# EAGLE schematic SVCSYNTH00 (EAGLE 7.7.0)

## Sheet 1 of 4
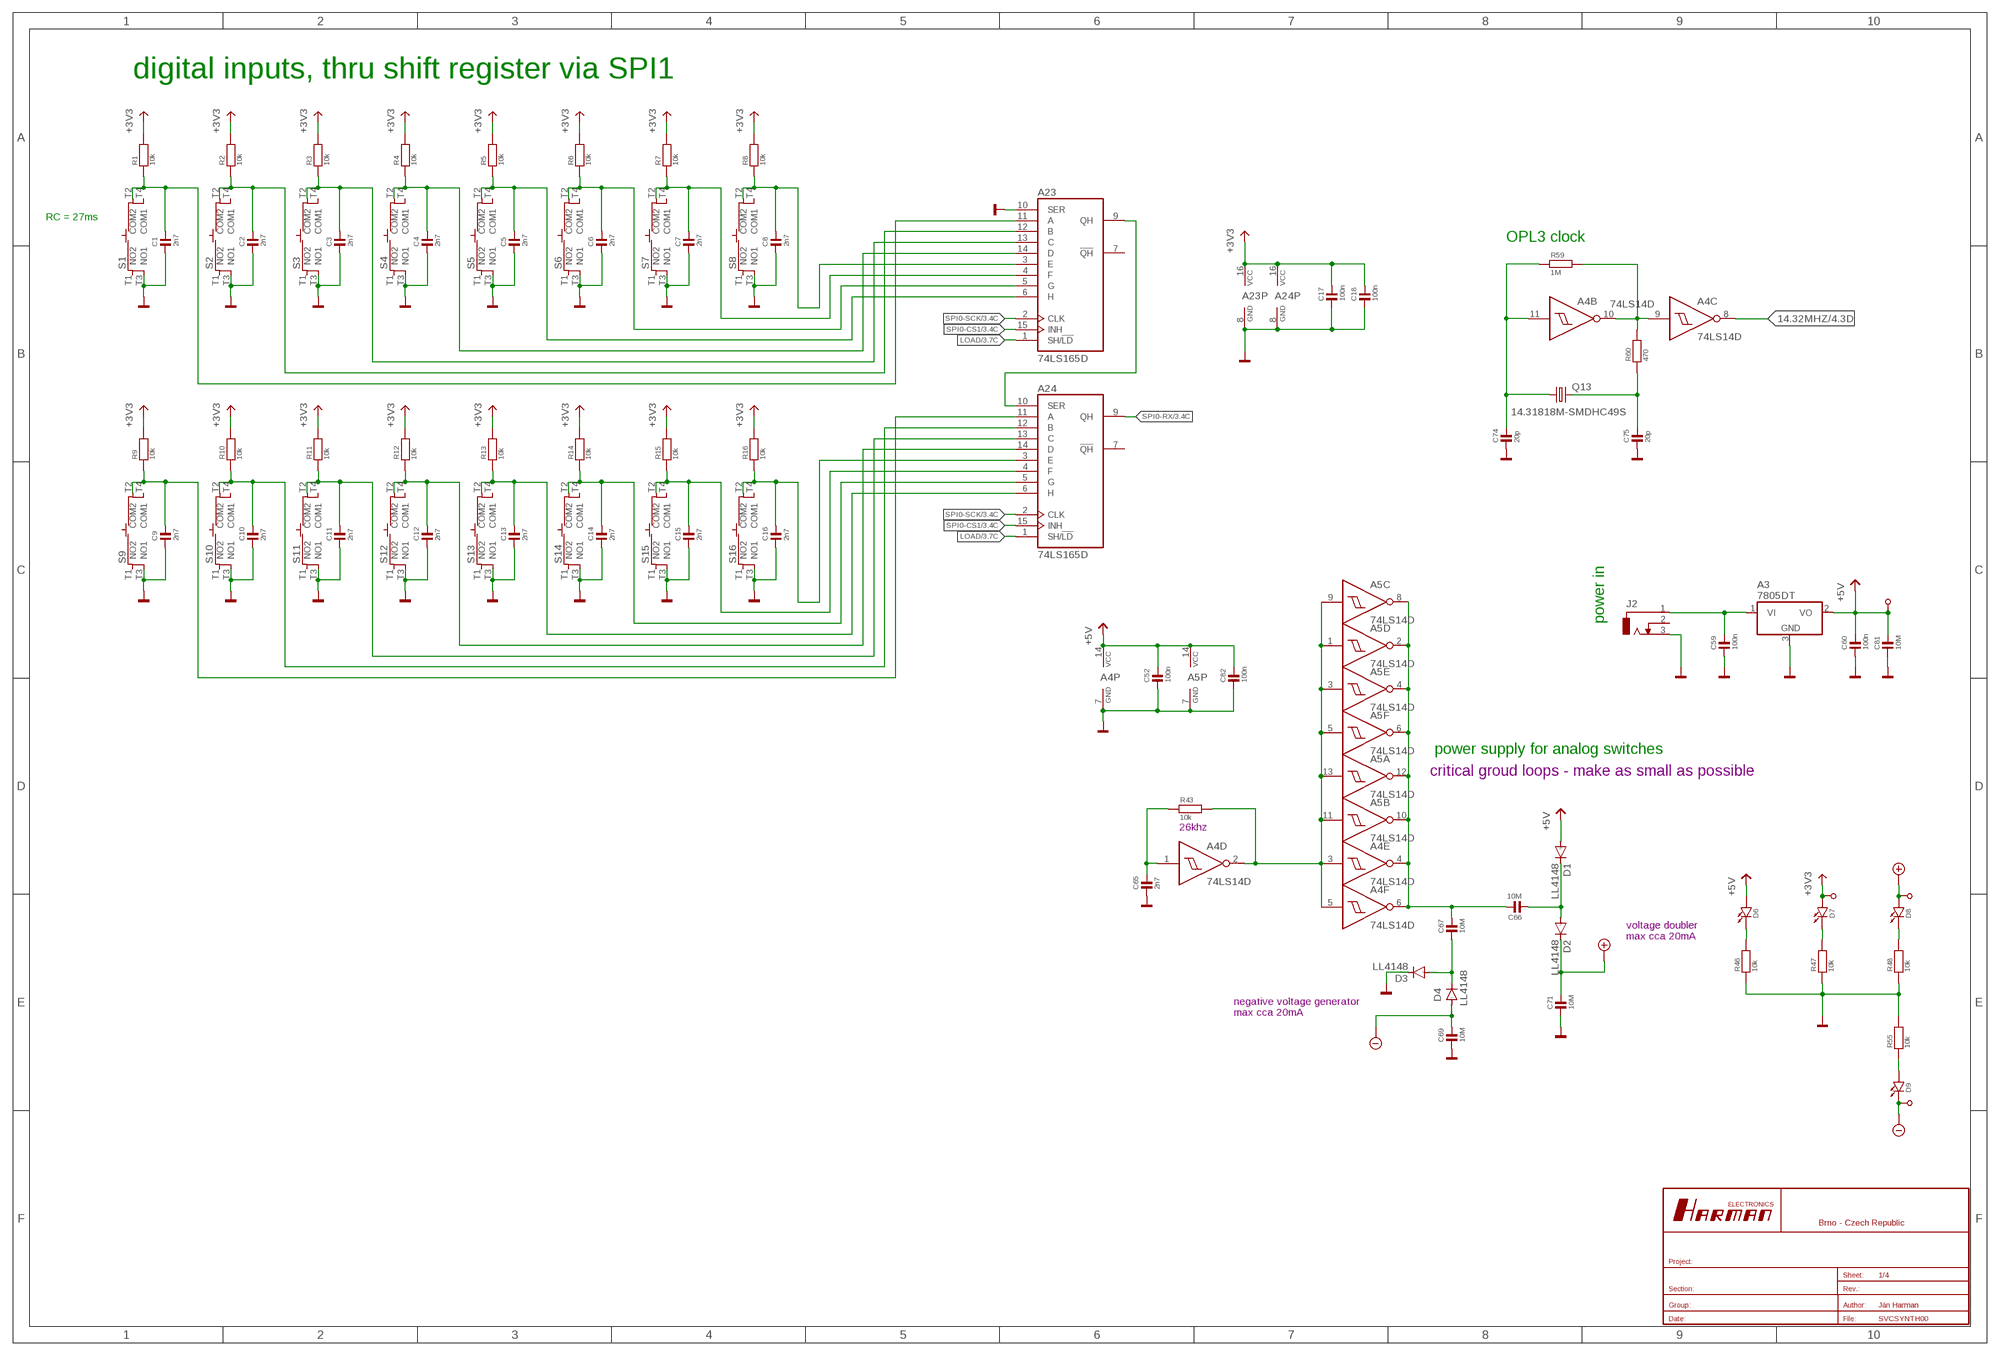
[diagram p0: schematic, sheet 1]

### Parts
A3  7805DT  [TO252]
A4  74LS14D  [SO14]
A5  74LS14D  [SO14]
A23  74LS165D  [SO16]
A24  74LS165D  [SO16]
C1  2n7  C0805  [R0805]
C2  2n7  C0805  [R0805]
C3  2n7  C0805  [R0805]
C4  2n7  C0805  [R0805]
C5  2n7  C0805  [R0805]
C6  2n7  C0805  [R0805]
C7  2n7  C0805  [R0805]
C8  2n7  C0805  [R0805]
C9  2n7  C0805  [R0805]
C10  2n7  C0805  [R0805]
C11  2n7  C0805  [R0805]
C12  2n7  C0805  [R0805]
C13  2n7  C0805  [R0805]
C14  2n7  C0805  [R0805]
C15  2n7  C0805  [R0805]
C16  2n7  C0805  [R0805]
C17  100n  C0805  [R0805]
C18  100n  C0805  [R0805]
C52  100n  C0805  [R0805]
C59  100n  C0805  [R0805]
C60  100n  C0805  [R0805]
C65  2n7  C0805  [R0805]
C66  10M  C1206  [R1206]
C67  10M  C1206  [R1206]
C69  10M  C1206  [R1206]
C71  10M  C1206  [R1206]
C74  20p  C0805  [R0805]
C75  20p  C0805  [R0805]
C81  10M  C1206  [R1206]
C82  100n  C0805  [R0805]
D1  LL4148  DIODE-SOD80C  [SOD80C]
D2  LL4148  DIODE-SOD80C  [SOD80C]
D3  LL4148  DIODE-SOD80C  [SOD80C]
D4  LL4148  DIODE-SOD80C  [SOD80C]
D6  LED3MM  [LED3MM]
D7  LED3MM  [LED3MM]
D8  LED3MM  [LED3MM]
D9  LED3MM  [LED3MM]
J2  DCJ0303  [DCJ0303]
K1  K1_0.9_1.8  [K_0.9_1.8]
K2  K1_0.9_1.8  [K_0.9_1.8]
K3  K1_0.9_1.8  [K_0.9_1.8]
K4  K1_0.9_1.8  [K_0.9_1.8]
Q13  14.31818M-SMDHC49S  CSM-7X-DU  [CSM-7X-DU]
R1  10k  R0805  [R0805]
R2  10k  R0805  [R0805]
R3  10k  R0805  [R0805]
R4  10k  R0805  [R0805]
R5  10k  R0805  [R0805]
R6  10k  R0805  [R0805]
R7  10k  R0805  [R0805]
R8  10k  R0805  [R0805]
R9  10k  R0805  [R0805]
R10  10k  R0805  [R0805]
R11  10k  R0805  [R0805]
R12  10k  R0805  [R0805]
R13  10k  R0805  [R0805]
R14  10k  R0805  [R0805]
R15  10k  R0805  [R0805]
R16  10k  R0805  [R0805]
R43  10k  R0805  [R0805]
R46  10k  R0805  [R0805]
R47  10k  R0805  [R0805]
R48  10k  R0805  [R0805]
R55  10k  R0805  [R0805]
R59  1M  R0805  [R0805]
R60  470  R0805  [R0805]
S1  101-TS6211T1603-EV  [101TS6211T1603EV]
S2  101-TS6211T1603-EV  [101TS6211T1603EV]
S3  101-TS6211T1603-EV  [101TS6211T1603EV]
S4  101-TS6211T1603-EV  [101TS6211T1603EV]
S5  101-TS6211T1603-EV  [101TS6211T1603EV]
S6  101-TS6211T1603-EV  [101TS6211T1603EV]
S7  101-TS6211T1603-EV  [101TS6211T1603EV]
S8  101-TS6211T1603-EV  [101TS6211T1603EV]
S9  101-TS6211T1603-EV  [101TS6211T1603EV]
S10  101-TS6211T1603-EV  [101TS6211T1603EV]
S11  101-TS6211T1603-EV  [101TS6211T1603EV]
S12  101-TS6211T1603-EV  [101TS6211T1603EV]
S13  101-TS6211T1603-EV  [101TS6211T1603EV]
S14  101-TS6211T1603-EV  [101TS6211T1603EV]
S15  101-TS6211T1603-EV  [101TS6211T1603EV]
S16  101-TS6211T1603-EV  [101TS6211T1603EV]

### Nets
14.32MHZ: A4.8(C:O) ; also sheet 4
+3V3: A23.16(VCC) A24.16(VCC) C17.2 C18.2 D7.A K4.1 R1.1 R2.1 R3.1 R4.1 R5.1 R6.1 R7.1 R8.1 R9.1 R10.1 R11.1 R12.1 R13.1 R14.1 R15.1 R16.1 ; also sheet 2,3,4
+5V: A3.2(VO) A4.14(P:VCC) A5.14(P:VCC) C52.2 C60.2 C81.2 C82.2 D1.A D6.A K1.1 ; also sheet 2,3,4
+9V: C71.2 D2.C D8.A K2.1 ; also sheet 2
-5V: C69.2 D4.A D9.K(C) K3.1 ; also sheet 2
GND: A3.3(GND) A4.7(P:GND) A5.7(P:GND) A23.8(GND) A23.10(SER) A24.8(GND) C1.1 C2.1 C3.1 C4.1 C5.1 C6.1 C7.1 C8.1 C9.1 C10.1 C11.1 C12.1 C13.1 C14.1 C15.1 C16.1 C17.1 C18.1 C52.1 C59.1 C60.1 C65.1 C69.1 C71.1 C74.1 C75.1 C81.1 C82.1 D3.C J2.3 R46.2 R47.2 R48.2 R55.1 S1.T3(NO1) S2.T3(NO1) S3.T3(NO1) S4.T3(NO1) S5.T3(NO1) S6.T3(NO1) S7.T3(NO1) S8.T3(NO1) S9.T3(NO1) S10.T3(NO1) S11.T3(NO1) S12.T3(NO1) S13.T3(NO1) S14.T3(NO1) S15.T3(NO1) S16.T3(NO1) ; also sheet 2,3,4
LOAD: A23.1(SH/!LD) A24.1(SH/!LD) ; also sheet 3
N$53: A4.11(B:I) C74.2 Q13.1 R59.2
N$66: C75.2 Q13.2 R60.2
N$67: A4.9(C:I) A4.10(B:O) R59.1 R60.1
N$68: A4.1(D:I) C65.2 R43.2
N$69: A4.2(D:O) A4.3(E:I) A4.5(F:I) A5.1(D:I) A5.3(E:I) A5.5(F:I) A5.9(C:I) A5.11(B:I) A5.13(A:I) R43.1
N$71: A4.4(E:O) A4.6(F:O) A5.2(D:O) A5.4(E:O) A5.6(F:O) A5.8(C:O) A5.10(B:O) A5.12(A:O) C66.2 C67.2
N$72: C67.1 D3.A D4.C
N$73: C66.1 D1.C D2.A
N$83: A23.11(A) C1.2 R1.2 S1.T2(COM2)
N$104: A23.9(QH) A24.10(SER)
N$105: A23.12(B) C2.2 R2.2 S2.T2(COM2)
N$106: A23.13(C) C3.2 R3.2 S3.T2(COM2)
N$107: A23.14(D) C4.2 R4.2 S4.T2(COM2)
N$108: A24.11(A) C9.2 R9.2 S9.T2(COM2)
N$109: A24.12(B) C10.2 R10.2 S10.T2(COM2)
N$110: A24.13(C) C11.2 R11.2 S11.T2(COM2)
N$111: A24.14(D) C12.2 R12.2 S12.T2(COM2)
N$112: A23.6(H) C5.2 R5.2 S5.T2(COM2)
N$113: A23.5(G) C6.2 R6.2 S6.T2(COM2)
N$114: A23.4(F) C7.2 R7.2 S7.T2(COM2)
N$115: A23.3(E) C8.2 R8.2 S8.T2(COM2)
N$116: A24.6(H) C13.2 R13.2 S13.T2(COM2)
N$117: A24.5(G) C14.2 R14.2 S14.T2(COM2)
N$118: A24.4(F) C15.2 R15.2 S15.T2(COM2)
N$119: A24.3(E) C16.2 R16.2 S16.T2(COM2)
N$153: A3.1(VI) C59.2 J2.1
N$156: D6.K(C) R46.1
N$157: D7.K(C) R47.1
N$158: D8.K(C) R48.1
N$159: D9.A R55.2
SPI0-CS1: A23.15(INH) A24.15(INH) ; also sheet 3
SPI0-RX: A24.9(QH) ; also sheet 3
SPI0-SCK: A23.2(CLK) A24.2(CLK) ; also sheet 3
Unconnected: A4.12(A:O) A4.13(A:I) A23.7(!QH) A24.7(!QH) J2.2 S1.T1(NO2) S1.T4(COM1) S2.T1(NO2) S2.T4(COM1) S3.T1(NO2) S3.T4(COM1) S4.T1(NO2) S4.T4(COM1) S5.T1(NO2) S5.T4(COM1) S6.T1(NO2) S6.T4(COM1) S7.T1(NO2) S7.T4(COM1) S8.T1(NO2) S8.T4(COM1) S9.T1(NO2) S9.T4(COM1) S10.T1(NO2) S10.T4(COM1) S11.T1(NO2) S11.T4(COM1) S12.T1(NO2) S12.T4(COM1) S13.T1(NO2) S13.T4(COM1) S14.T1(NO2) S14.T4(COM1) S15.T1(NO2) S15.T4(COM1) S16.T1(NO2) S16.T4(COM1)

### Notes on the sheet
- digital inputs, thru shift register via SPI1
- RC = 27ms
- OPL3 clock
- power in
- power supply for analog switches
- critical groud loops - make as small as possible
- 26khz
- voltage doubler
- max cca 20mA
- negative voltage generator
- max cca 20mA

## Sheet 2 of 4
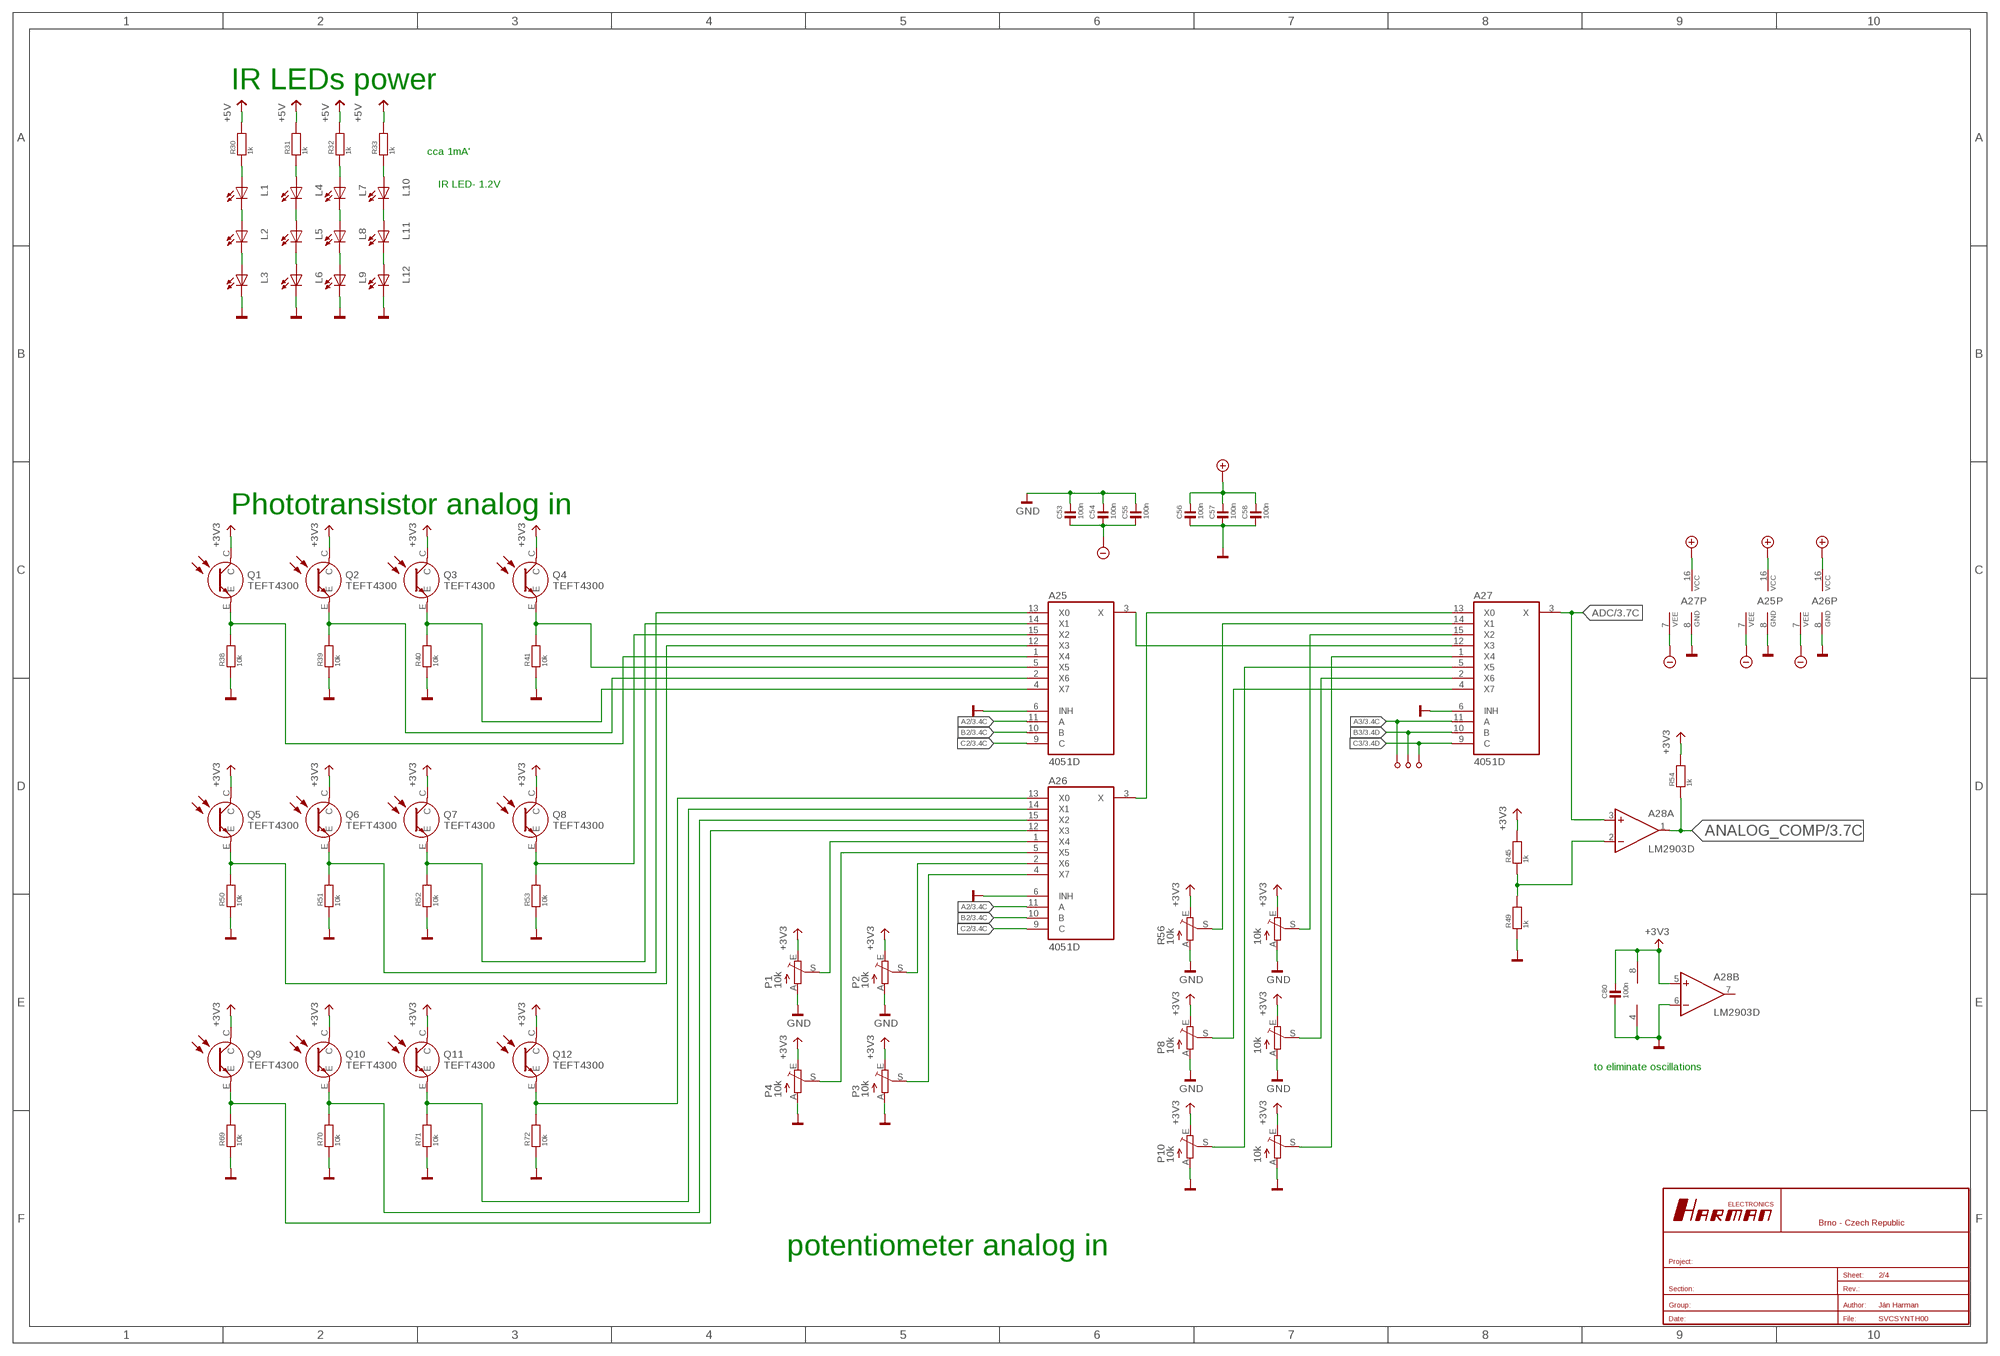
[diagram p1: schematic, sheet 2]

### Parts
A25  4051D  [SO16]
A26  4051D  [SO16]
A27  4051D  [SO16]
A28  LM2903D  [SO08]
C53  100n  C0805  [R0805]
C54  100n  C0805  [R0805]
C55  100n  C0805  [R0805]
C56  100n  C0805  [R0805]
C57  100n  C0805  [R0805]
C58  100n  C0805  [R0805]
C80  100n  C0805  [R0805]
K8  K1_0.8_1.6  [K_0.8_1.6]
K9  K1_0.8_1.6  [K_0.8_1.6]
K10  K1_0.8_1.6  [K_0.8_1.6]
L1  LED3MM  [LED3MM]
L2  LED3MM  [LED3MM]
L3  LED3MM  [LED3MM]
L4  LED3MM  [LED3MM]
L5  LED3MM  [LED3MM]
L6  LED3MM  [LED3MM]
L7  LED3MM  [LED3MM]
L8  LED3MM  [LED3MM]
L9  LED3MM  [LED3MM]
L10  LED3MM  [LED3MM]
L11  LED3MM  [LED3MM]
L12  LED3MM  [LED3MM]
P1  10k  TRIM_EU-CA6V  [CA6V]
P2  10k  TRIM_EU-CA6V  [CA6V]
P3  10k  TRIM_EU-CA6V  [CA6V]
P4  10k  TRIM_EU-CA6V  [CA6V]
P6  10k  TRIM_EU-CA6V  [CA6V]
P8  10k  TRIM_EU-CA6V  [CA6V]
P10  10k  TRIM_EU-CA6V  [CA6V]
Q1  TEFT4300  [TEFT4300]
Q2  TEFT4300  [TEFT4300]
Q3  TEFT4300  [TEFT4300]
Q4  TEFT4300  [TEFT4300]
Q5  TEFT4300  [TEFT4300]
Q6  TEFT4300  [TEFT4300]
Q7  TEFT4300  [TEFT4300]
Q8  TEFT4300  [TEFT4300]
Q9  TEFT4300  [TEFT4300]
Q10  TEFT4300  [TEFT4300]
Q11  TEFT4300  [TEFT4300]
Q12  TEFT4300  [TEFT4300]
R30  1k  R0805  [R0805]
R31  1k  R0805  [R0805]
R32  1k  R0805  [R0805]
R33  1k  R0805  [R0805]
R38  10k  R0805  [R0805]
R39  10k  R0805  [R0805]
R40  10k  R0805  [R0805]
R41  10k  R0805  [R0805]
R45  1k  R0805  [R0805]
R49  1k  R0805  [R0805]
R50  10k  R0805  [R0805]
R51  10k  R0805  [R0805]
R52  10k  R0805  [R0805]
R53  10k  R0805  [R0805]
R54  1k  R0805  [R0805]
R56  10k  TRIM_EU-CA6V  [CA6V]
R57  10k  TRIM_EU-CA6V  [CA6V]
R69  10k  R0805  [R0805]
R70  10k  R0805  [R0805]
R71  10k  R0805  [R0805]
R72  10k  R0805  [R0805]
R74  10k  TRIM_EU-CA6V  [CA6V]

### Nets
+3V3: A28.5(B:+IN) A28.8(P:V+) C80.2 P1.E P2.E P3.E P4.E P6.E P8.E P10.E Q1.C Q2.C Q3.C Q4.C Q5.C Q6.C Q7.C Q8.C Q9.C Q10.C Q11.C Q12.C R45.1 R54.1 R56.E R57.E R74.E ; also sheet 1,3,4
+5V: R30.1 R31.1 R32.1 R33.1 ; also sheet 1,3,4
+9V: A25.16(VCC) A26.16(VCC) A27.16(VCC) C56.2 C57.2 C58.2 ; also sheet 1
-5V: A25.7(VEE) A26.7(VEE) A27.7(VEE) C53.1 C54.1 C55.1 ; also sheet 1
A2: A25.11(A) A26.11(A) ; also sheet 3
A3: A27.11(A) K8.1 ; also sheet 3
ADC: A27.3(X) A28.3(A:+IN) ; also sheet 3
ANALOG_COMP: A28.1(A:OUT) R54.2 ; also sheet 3
B2: A25.10(B) A26.10(B) ; also sheet 3
B3: A27.10(B) K9.1 ; also sheet 3
C2: A25.9(C) A26.9(C) ; also sheet 3
C3: A27.9(C) K10.1 ; also sheet 3
GND: A25.6(INH) A25.8(GND) A26.6(INH) A26.8(GND) A27.6(INH) A27.8(GND) A28.4(P:V-) A28.6(B:-IN) C53.2 C54.2 C55.2 C56.1 C57.1 C58.1 C80.1 L3.K(C) L6.K(C) L9.K(C) L12.K(C) P1.A P2.A P3.A P4.A P6.A P8.A P10.A R38.2 R39.2 R40.2 R41.2 R49.2 R50.2 R51.2 R52.2 R53.2 R56.A R57.A R69.2 R70.2 R71.2 R72.2 R74.A ; also sheet 1,3,4
N$70: A25.3(X) A27.12(X3)
N$74: A26.3(X) A27.13(X0)
N$75: A27.14(X1) R56.S
N$76: A27.4(X7) P8.S
N$77: A27.5(X5) P10.S
N$78: A27.15(X2) R57.S
N$79: L1.A R30.2
N$80: L1.K(C) L2.A
N$81: L2.K(C) L3.A
N$82: A25.5(X5) Q4.E R41.1
N$84: L5.K(C) L6.A
N$85: L4.K(C) L5.A
N$86: L4.A R31.2
N$87: L7.A R32.2
N$88: L7.K(C) L8.A
N$89: L8.K(C) L9.A
N$91: L11.K(C) L12.A
N$92: L10.K(C) L11.A
N$93: A25.4(X7) Q3.E R40.1
N$94: A25.2(X6) Q2.E R39.1
N$95: A25.1(X4) Q1.E R38.1
N$96: A25.15(X2) Q8.E R53.1
N$97: A25.14(X1) Q7.E R52.1
N$98: A25.13(X0) Q6.E R51.1
N$99: A25.12(X3) Q5.E R50.1
N$100: A26.13(X0) Q12.E R72.1
N$101: A26.14(X1) Q11.E R71.1
N$102: A26.15(X2) Q10.E R70.1
N$103: A26.12(X3) Q9.E R69.1
N$120: A26.1(X4) P1.S
N$121: A26.5(X5) P4.S
N$122: A26.2(X6) P2.S
N$123: A26.4(X7) P3.S
N$124: A27.2(X6) P6.S
N$125: A27.1(X4) R74.S
N$126: A28.2(A:-IN) R45.2 R49.1
N$142: L10.A R33.2
Unconnected: A28.7(B:OUT)

### Notes on the sheet
- IR LEDs power
- cca 1mA'
- IR LED- 1.2V
- Phototransistor analog in
- to eliminate oscillations
- potentiometer analog in

## Sheet 3 of 4
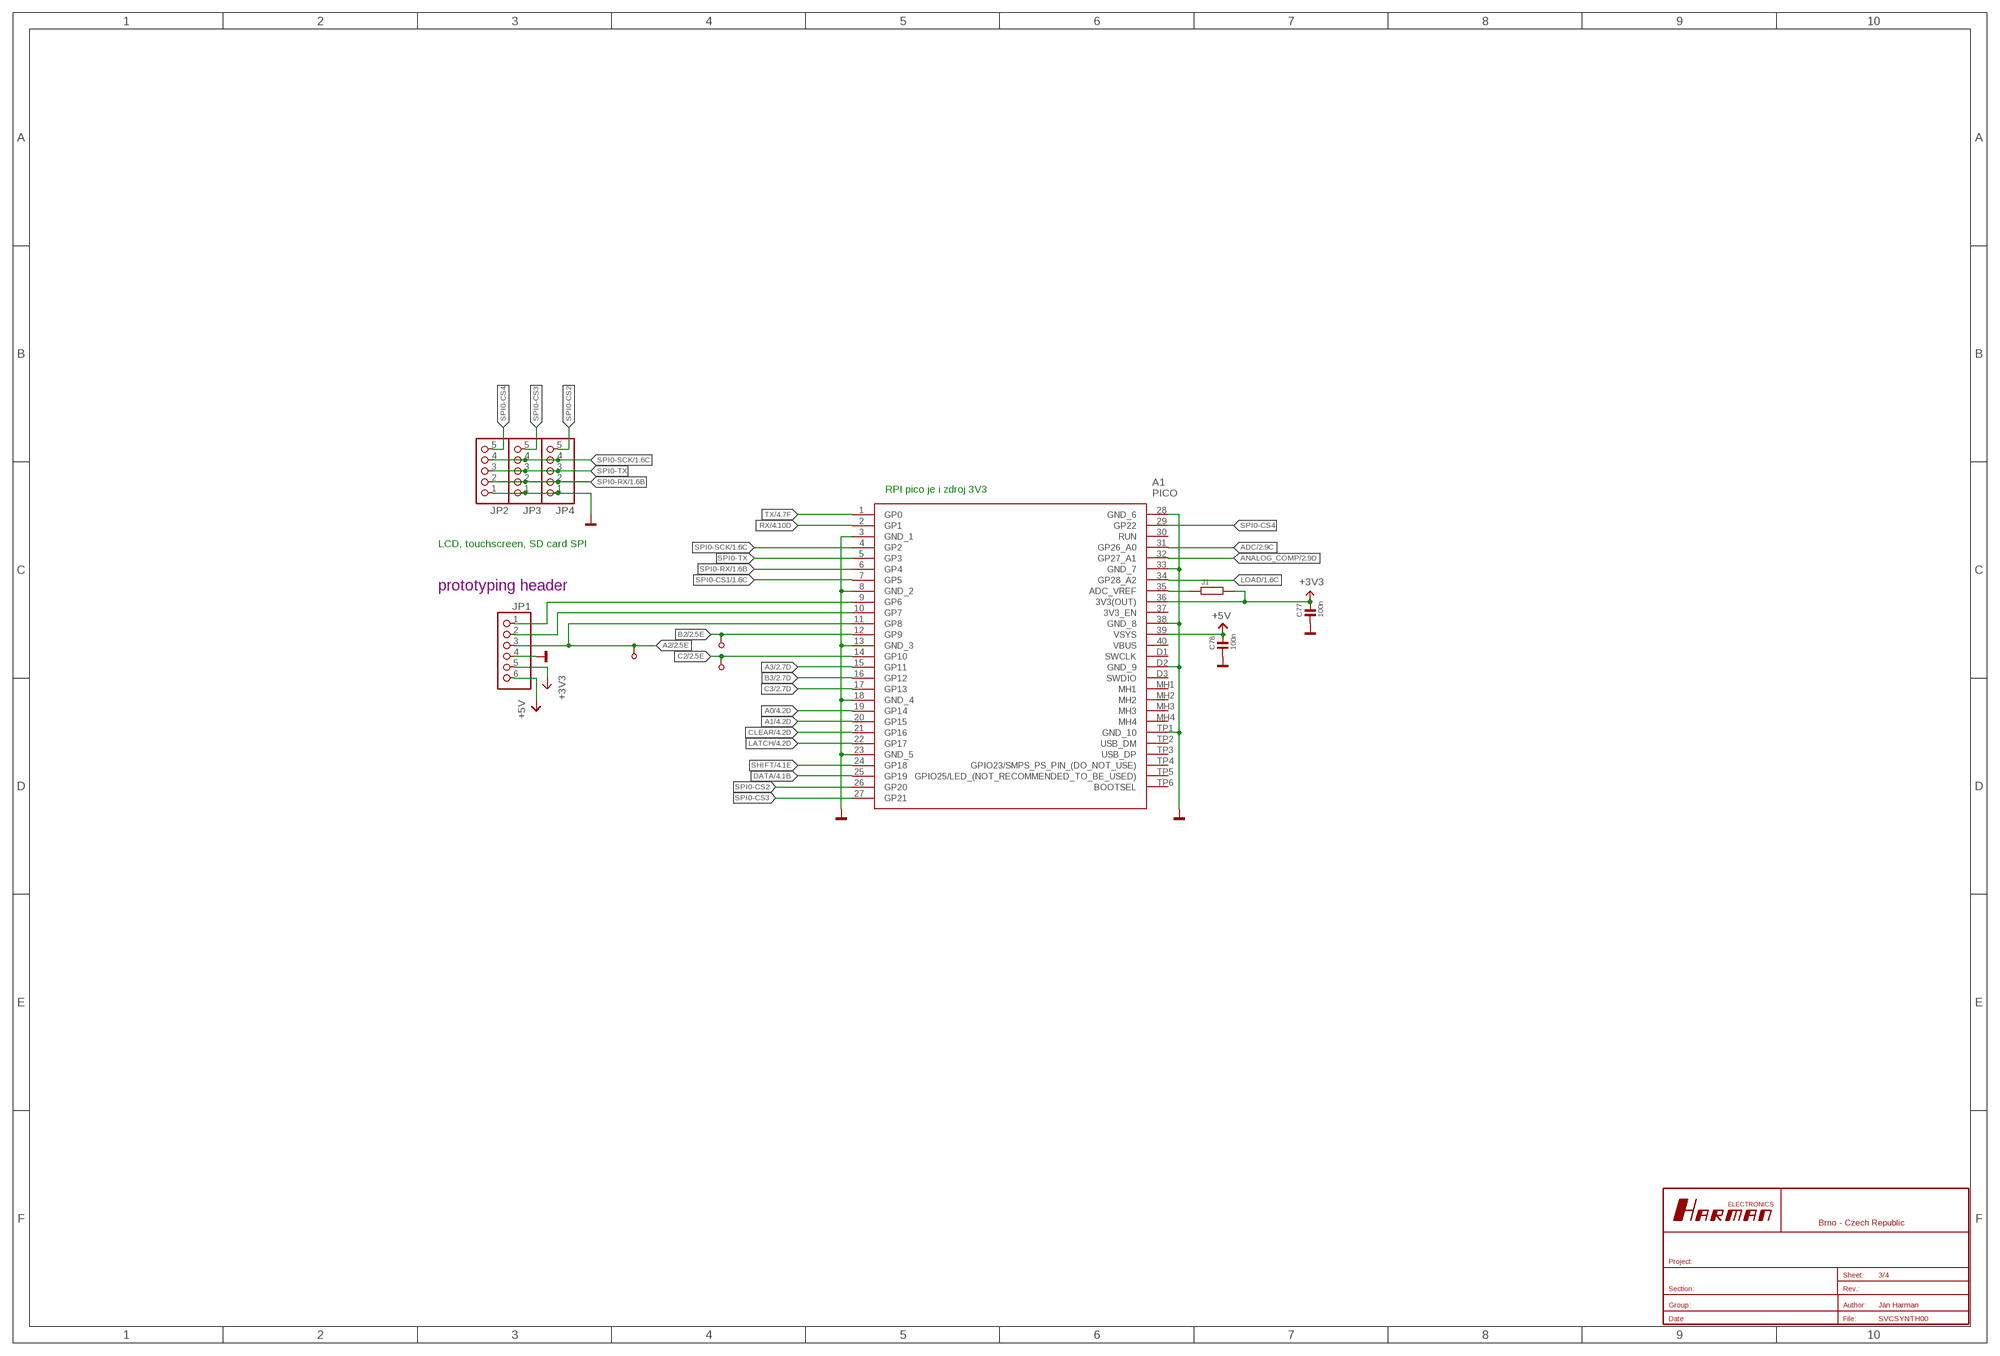
[diagram p2: schematic, sheet 3]

### Parts
A1  PICO  [PICO]
C77  100n  C0805  [R0805]
C78  100n  C0805  [R0805]
J1  R0402  [R0402]
JP1  PINHD-1X6  [1X06]
JP2  PINHD-1X5  [1X05]
JP3  PINHD-1X5  [1X05]
JP4  PINHD-1X5  [1X05]
K5  K1_1.0_2.2  [K_1.0_2.2]
K6  K1_1.0_2.2  [K_1.0_2.2]
K7  K1_1.0_2.2  [K_1.0_2.2]

### Nets
+3V3: A1.36(3V3(OUT)) C77.2 J1.2 JP1.5 ; also sheet 1,2,4
+5V: A1.39(VSYS) C78.2 JP1.6 ; also sheet 1,2,4
A0: A1.19(GP14) ; also sheet 4
A1: A1.20(GP15) ; also sheet 4
A2: A1.11(GP8) JP1.3 K5.1 ; also sheet 2
A3: A1.15(GP11) ; also sheet 2
ADC: A1.31(GP26_A0) ; also sheet 2
ANALOG_COMP: A1.32(GP27_A1) ; also sheet 2
B2: A1.12(GP9) K7.1 ; also sheet 2
B3: A1.16(GP12) ; also sheet 2
C2: A1.14(GP10) K6.1 ; also sheet 2
C3: A1.17(GP13) ; also sheet 2
CLEAR: A1.21(GP16) ; also sheet 4
DATA: A1.25(GP19) ; also sheet 4
GND: A1.3(GND_1) A1.8(GND_2) A1.13(GND_3) A1.18(GND_4) A1.23(GND_5) A1.28(GND_6) A1.33(GND_7) A1.38(GND_8) A1.D2(GND_9) A1.TP1(GND_10) C77.1 C78.1 JP1.4 JP2.1 JP3.1 JP4.1 ; also sheet 1,2,4
LATCH: A1.22(GP17) ; also sheet 4
LOAD: A1.34(GP28_A2) ; also sheet 1
N$90: A1.35(ADC_VREF) J1.1
N$127: A1.9(GP6) JP1.1
N$128: A1.10(GP7) JP1.2
RX: A1.2(GP1) ; also sheet 4
SHIFT: A1.24(GP18) ; also sheet 4
SPI0-CS1: A1.7(GP5) ; also sheet 1
SPI0-CS2: A1.26(GP20) JP4.5
SPI0-CS3: A1.27(GP21) JP3.5
SPI0-CS4: A1.29(GP22) JP2.5
SPI0-RX: A1.6(GP4) JP2.2 JP3.2 JP4.2 ; also sheet 1
SPI0-SCK: A1.4(GP2) JP2.4 JP3.4 JP4.4 ; also sheet 1
SPI0-TX: A1.5(GP3) JP2.3 JP3.3 JP4.3
TX: A1.1(GP0) ; also sheet 4
Unconnected: A1.30(RUN) A1.37(3V3_EN) A1.40(VBUS) A1.D1(SWCLK) A1.D3(SWDIO) A1.MH1 A1.MH2 A1.MH3 A1.MH4 A1.TP2(USB_DM) A1.TP3(USB_DP) A1.TP4(GPIO23/SMPS_PS_PIN_(DO_NOT_USE)) A1.TP5(GPIO25/LED_(NOT_RECOMMENDED_TO_BE_USED)) A1.TP6(BOOTSEL)

### Notes on the sheet
- RPI pico je i zdroj 3V3
- LCD, touchscreen, SD card SPI
- prototyping header

## Sheet 4 of 4
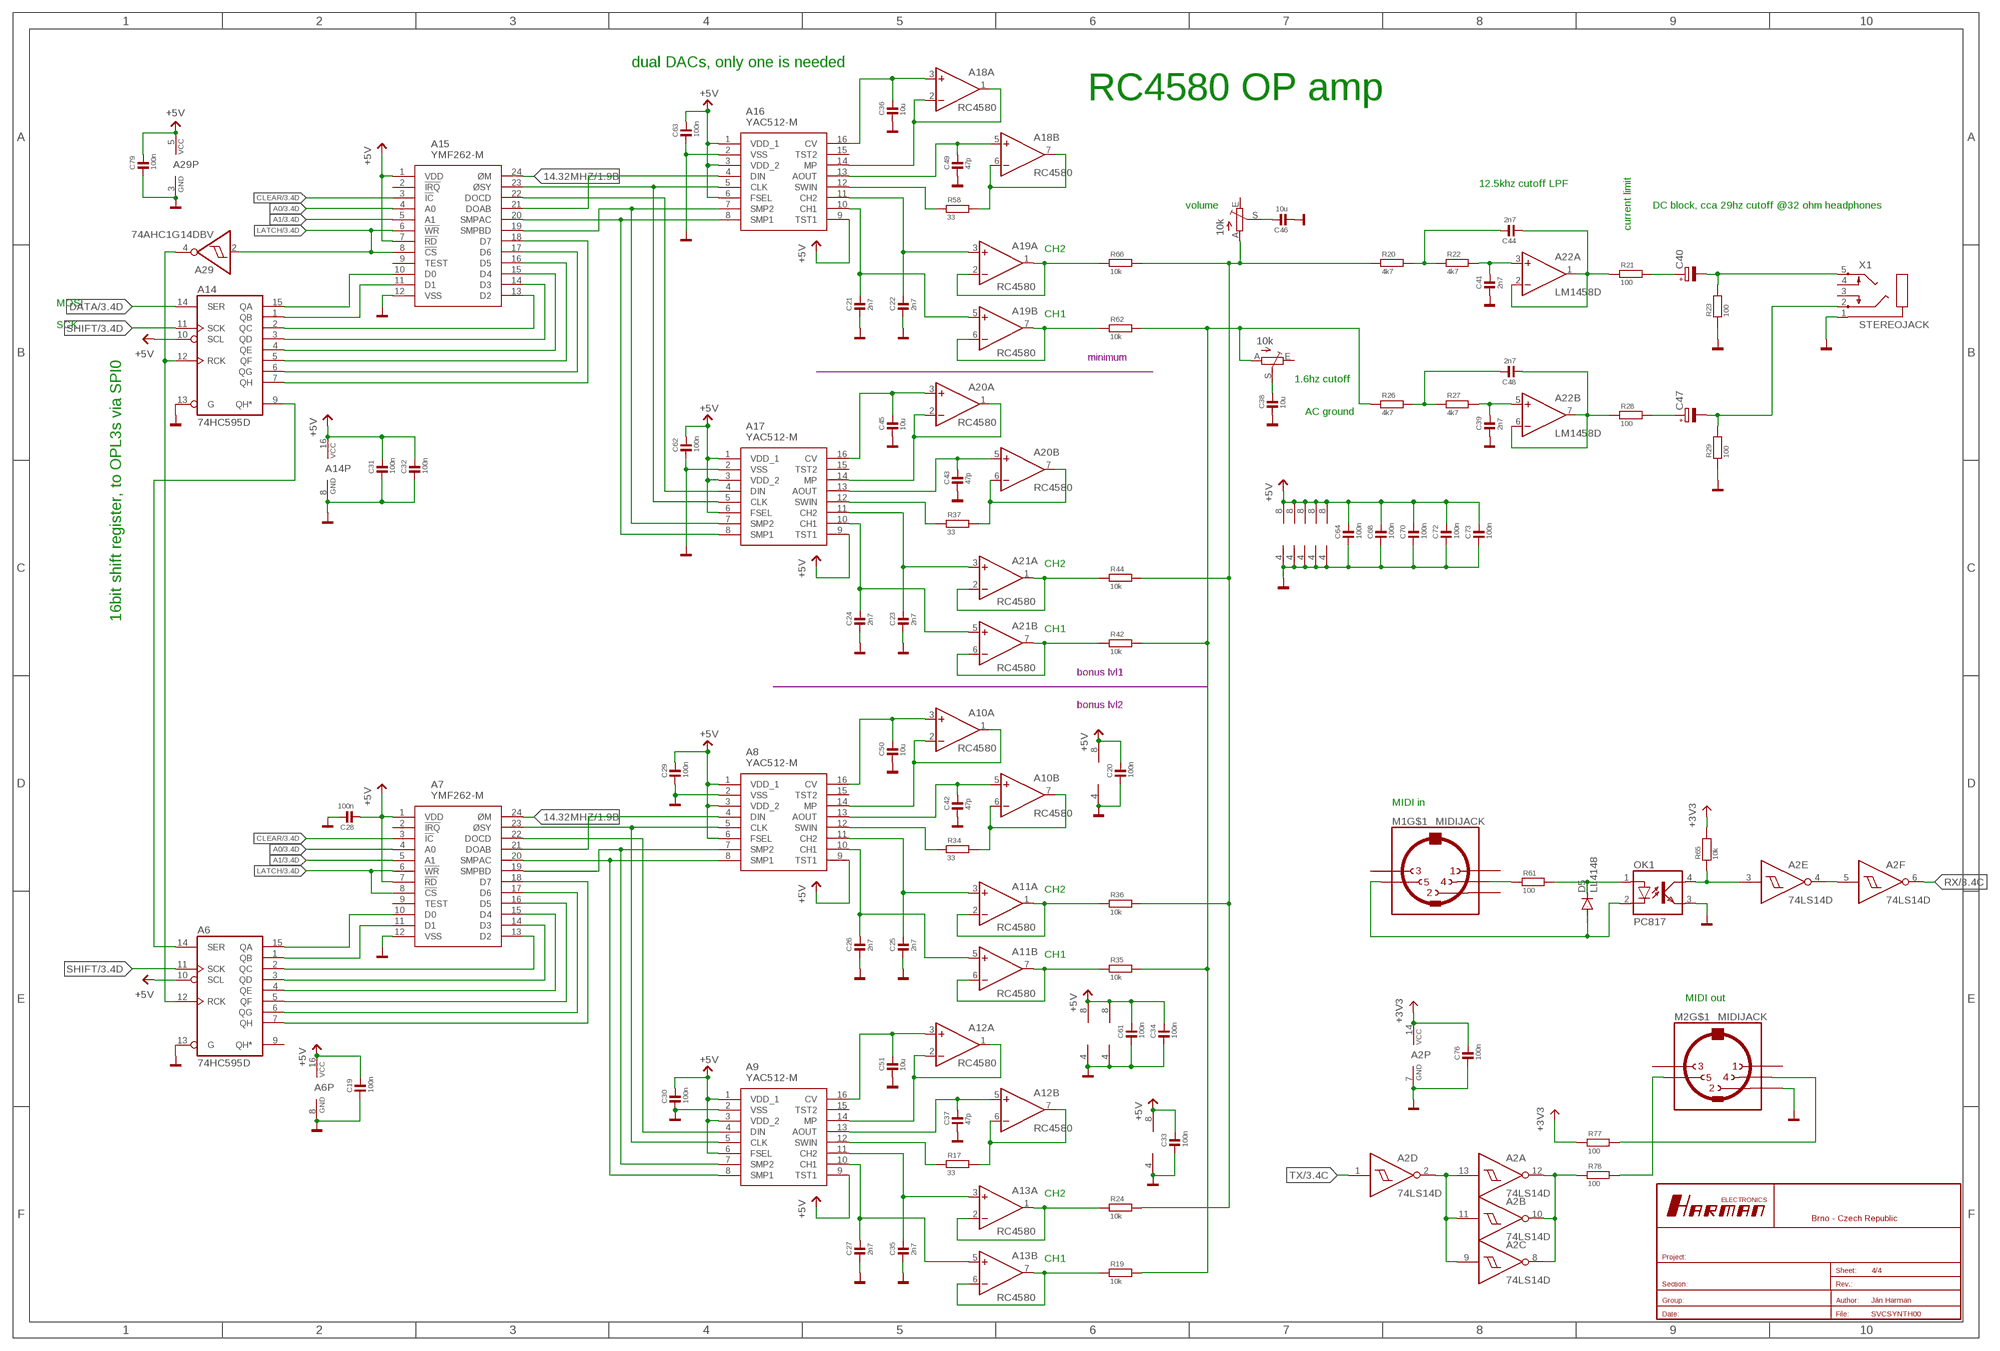
[diagram p3: schematic, sheet 4]

### Parts
A2  74LS14D  [SO14]
A6  74HC595D  [SO16]
A7  YMF262-M  [SOIC127P1180X250-24N]
A8  YAC512-M  [SOIC127P780X230-16N]
A9  YAC512-M  [SOIC127P780X230-16N]
A10  RC4580  LM1458D  [SO08]
A11  RC4580  LM1458D  [SO08]
A12  RC4580  LM1458D  [SO08]
A13  RC4580  LM1458D  [SO08]
A14  74HC595D  [SO16]
A15  YMF262-M  [SOIC127P1180X250-24N]
A16  YAC512-M  [SOIC127P780X230-16N]
A17  YAC512-M  [SOIC127P780X230-16N]
A18  RC4580  LM1458D  [SO08]
A19  RC4580  LM1458D  [SO08]
A20  RC4580  LM1458D  [SO08]
A21  RC4580  LM1458D  [SO08]
A22  LM1458D  [SO08]
A29  74AHC1G14DBV  [SOT23-5]
C19  100n  C0805  [R0805]
C20  100n  C0805  [R0805]
C21  2n7  C0805  [R0805]
C22  2n7  C0805  [R0805]
C23  2n7  C0805  [R0805]
C24  2n7  C0805  [R0805]
C25  2n7  C0805  [R0805]
C26  2n7  C0805  [R0805]
C27  2n7  C0805  [R0805]
C28  100n  C0805  [R0805]
C29  100n  C0805  [R0805]
C30  100n  C0805  [R0805]
C31  100n  C0805  [R0805]
C32  100n  C0805  [R0805]
C33  100n  C0805  [R0805]
C34  100n  C0805  [R0805]
C35  2n7  C0805  [R0805]
C36  10u  C0805  [R0805]
C37  47p  C0805  [R0805]
C38  10u  C0805  [R0805]
C39  2n7  C0805  [R0805]
C40  CPOL-EUE3.5-8  [E3,5-8]
C41  2n7  C0805  [R0805]
C42  47p  C0805  [R0805]
C43  47p  C0805  [R0805]
C44  2n7  C0805  [R0805]
C45  10u  C0805  [R0805]
C46  10u  C0805  [R0805]
C47  CPOL-EUE3.5-8  [E3,5-8]
C48  2n7  C0805  [R0805]
C49  47p  C0805  [R0805]
C50  10u  C0805  [R0805]
C51  10u  C0805  [R0805]
C61  100n  C0805  [R0805]
C62  100n  C0805  [R0805]
C63  100n  C0805  [R0805]
C64  100n  C0805  [R0805]
C68  100n  C0805  [R0805]
C70  100n  C0805  [R0805]
C72  100n  C0805  [R0805]
C73  100n  C0805  [R0805]
C76  100n  C0805  [R0805]
C79  100n  C0805  [R0805]
D5  LL4148  DIODE-SOD80C  [SOD80C]
M1  MIDIJACK  [CP-2350]
M2  MIDIJACK  [CP-2350]
OK1  PC817  [DIL04]
R17  33  R0805  [R0805]
R18  10k  TRIM_EU-CA6V  [CA6V]
R19  10k  R0805  [R0805]
R20  4k7  R0805  [R0805]
R21  100  R0805  [R0805]
R22  4k7  R0805  [R0805]
R23  100  R0805  [R0805]
R24  10k  R0805  [R0805]
R25  10k  TRIM_EU-CA6V  [CA6V]
R26  4k7  R0805  [R0805]
R27  4k7  R0805  [R0805]
R28  100  R0805  [R0805]
R29  100  R0805  [R0805]
R34  33  R0805  [R0805]
R35  10k  R0805  [R0805]
R36  10k  R0805  [R0805]
R37  33  R0805  [R0805]
R42  10k  R0805  [R0805]
R44  10k  R0805  [R0805]
R58  33  R0805  [R0805]
R61  100  R0805  [R0805]
R62  10k  R0805  [R0805]
R65  10k  R0805  [R0805]
R66  10k  R0805  [R0805]
R77  100  R0805  [R0805]
R78  100  R0805  [R0805]
X1  STEREOJACK  [STX3100]

### Nets
14.32MHZ: A7.24(ØM) A15.24(ØM) ; also sheet 1
+3V3: A2.14(P:VCC) C76.2 R65.1 R77.2 ; also sheet 1,2,3
+5V: A6.10(SCL) A6.16(VCC) A7.1(VDD) A7.7(!RD) A8.1(VDD_1) A8.3(VDD_2) A8.6(FSEL) A8.9(TST1) A9.1(VDD_1) A9.3(VDD_2) A9.6(FSEL) A9.9(TST1) A10.8(P:V+) A11.8(P:V+) A12.8(P:V+) A13.8(P:V+) A14.10(SCL) A14.16(VCC) A15.1(VDD) A15.7(!RD) A16.1(VDD_1) A16.3(VDD_2) A16.6(FSEL) A16.9(TST1) A17.1(VDD_1) A17.3(VDD_2) A17.6(FSEL) A17.9(TST1) A18.8(P:V+) A19.8(P:V+) A20.8(P:V+) A21.8(P:V+) A22.8(P:V+) A29.5(VCC) C19.2 C20.2 C28.1 C29.2 C30.2 C31.2 C32.2 C33.2 C34.2 C61.2 C62.2 C63.2 C64.2 C68.2 C70.2 C72.2 C73.2 C79.2 ; also sheet 1,2,3
A0: A7.4(A0) A15.4(A0) ; also sheet 3
A1: A7.5(A1) A15.5(A1) ; also sheet 3
CLEAR: A7.3(!IC) A15.3(!IC) ; also sheet 3
DATA: A14.14(SER) ; also sheet 3
GND: A2.7(P:GND) A6.8(GND) A6.13(G) A7.12(VSS) A8.2(VSS) A9.2(VSS) A10.4(P:V-) A11.4(P:V-) A12.4(P:V-) A13.4(P:V-) A14.8(GND) A14.13(G) A15.12(VSS) A16.2(VSS) A17.2(VSS) A18.4(P:V-) A19.4(P:V-) A20.4(P:V-) A21.4(P:V-) A22.4(P:V-) A29.3(GND) C19.1 C20.1 C21.1 C22.1 C23.1 C24.1 C25.1 C26.1 C27.1 C28.2 C29.1 C30.1 C31.1 C32.1 C33.1 C34.1 C35.1 C36.1 C37.1 C38.1 C39.1 C41.1 C42.1 C43.1 C45.1 C46.1 C49.1 C50.1 C51.1 C61.1 C62.1 C63.1 C64.1 C68.1 C70.1 C72.1 C73.1 C76.1 C79.1 M2.2 OK1.3(EMIT) R23.2 R29.2 X1.1 ; also sheet 1,2,3
LATCH: A7.6(!WR) A7.8(!CS) A15.6(!WR) A15.8(!CS) A29.2(I) ; also sheet 3
N$1: A16.13(AOUT) A18.5(B:+IN) C49.2
N$2: A16.14(MP) A18.1(A:OUT) A18.2(A:-IN)
N$3: A16.16(CV) A18.3(A:+IN) C36.2
N$4: A18.6(B:-IN) A18.7(B:OUT) R58.1
N$5: A16.12(SWIN) R58.2
N$6: A16.10(CH1) A19.5(B:+IN) C21.2
N$7: A16.11(CH2) A19.3(A:+IN) C22.2
N$8: A19.1(A:OUT) A19.2(A:-IN) R66.2
N$9: A19.6(B:-IN) A19.7(B:OUT) R62.2
N$10: A14.15(QA) A15.10(D0)
N$11: A14.1(QB) A15.11(D1)
N$12: A14.2(QC) A15.13(D2)
N$13: A14.3(QD) A15.14(D3)
N$14: A14.4(QE) A15.15(D4)
N$15: A14.5(QF) A15.16(D5)
N$16: A14.6(QG) A15.17(D6)
N$17: A14.7(QH) A15.18(D7)
N$18: A15.20(SMPAC) A16.8(SMP1) A17.8(SMP1)
N$19: A8.14(MP) A10.1(A:OUT) A10.2(A:-IN)
N$20: A15.21(DOAB) A16.4(DIN)
N$21: A15.23(ØSY) A16.5(CLK) A17.5(CLK)
N$22: A17.14(MP) A20.1(A:OUT) A20.2(A:-IN)
N$23: A6.12(RCK) A14.12(RCK) A29.4(O)
N$24: A17.16(CV) A20.3(A:+IN) C45.2
N$25: A17.13(AOUT) A20.5(B:+IN) C43.2
N$26: A20.6(B:-IN) A20.7(B:OUT) R37.1
N$27: A17.12(SWIN) R37.2
N$28: A17.10(CH1) A21.5(B:+IN) C24.2
N$29: A17.11(CH2) A21.3(A:+IN) C23.2
N$30: A21.1(A:OUT) A21.2(A:-IN) R44.2
N$31: A21.6(B:-IN) A21.7(B:OUT) R42.2
N$32: A15.19(SMPBD) A16.7(SMP2) A17.7(SMP2)
N$33: A15.22(DOCD) A17.4(DIN)
N$34: A8.16(CV) A10.3(A:+IN) C50.2
N$35: A8.13(AOUT) A10.5(B:+IN) C42.2
N$36: A10.6(B:-IN) A10.7(B:OUT) R34.1
N$37: A8.12(SWIN) R34.2
N$38: A8.10(CH1) A11.5(B:+IN) C26.2
N$39: A8.11(CH2) A11.3(A:+IN) C25.2
N$40: A11.1(A:OUT) A11.2(A:-IN) R36.2
N$41: A11.6(B:-IN) A11.7(B:OUT) R35.2
N$42: A6.15(QA) A7.10(D0)
N$43: A6.1(QB) A7.11(D1)
N$44: A6.2(QC) A7.13(D2)
N$45: A6.3(QD) A7.14(D3)
N$46: A6.4(QE) A7.15(D4)
N$47: A6.5(QF) A7.16(D5)
N$48: A6.6(QG) A7.17(D6)
N$49: A6.7(QH) A7.18(D7)
N$50: A7.20(SMPAC) A8.8(SMP1) A9.8(SMP1)
N$51: A7.21(DOAB) A8.4(DIN)
N$52: A7.23(ØSY) A8.5(CLK) A9.5(CLK)
N$54: A9.14(MP) A12.1(A:OUT) A12.2(A:-IN)
N$55: A9.16(CV) A12.3(A:+IN) C51.2
N$56: A9.13(AOUT) A12.5(B:+IN) C37.2
N$57: A12.6(B:-IN) A12.7(B:OUT) R17.1
N$58: A9.12(SWIN) R17.2
N$59: A9.10(CH1) A13.5(B:+IN) C27.2
N$60: A9.11(CH2) A13.3(A:+IN) C35.2
N$61: A13.1(A:OUT) A13.2(A:-IN) R24.2
N$62: A13.6(B:-IN) A13.7(B:OUT) R19.2
N$63: A7.19(SMPBD) A8.7(SMP2) A9.7(SMP2)
N$64: A7.22(DOCD) A9.4(DIN)
N$65: A6.14(SER) A14.9(QH*)
N$130: A22.3(A:+IN) C41.2 R22.1
N$131: R19.1 R25.A R26.2 R35.1 R42.1 R62.1
N$132: C38.2 R25.S
N$133: R18.A R20.2 R24.1 R36.1 R44.1 R66.1
N$134: C46.2 R18.S
N$135: C44.2 R20.1 R22.2
N$136: A22.5(B:+IN) C39.2 R27.1
N$137: A22.1(A:OUT) A22.2(A:-IN) C44.1 R21.2
N$138: C48.2 R26.1 R27.2
N$139: A22.6(B:-IN) A22.7(B:OUT) C48.1 R28.2
N$140: C40.+ R21.1
N$141: C40.- R23.1 X1.5
N$143: C47.+ R28.1
N$144: C47.- R29.1 X1.2
N$145: A2.2(D:O) A2.9(C:I) A2.11(B:I) A2.13(A:I)
N$147: A2.4(E:O) A2.5(F:I)
N$148: M2.5 R78.1
N$149: A2.8(C:O) A2.10(B:O) A2.12(A:O) R78.2
N$150: M1.4 R61.2
N$151: M2.4 R77.1
N$152: D5.A M1.5 OK1.2(C)
N$154: D5.C OK1.1(A) R61.1
N$155: A2.3(E:I) OK1.4(COL) R65.2
RX: A2.6(F:O) ; also sheet 3
SHIFT: A6.11(SCK) A14.11(SCK) ; also sheet 3
TX: A2.1(D:I) ; also sheet 3
Unconnected: A6.9(QH*) A7.2(!IRQ) A7.9(TEST) A8.15(TST2) A9.15(TST2) A15.2(!IRQ) A15.9(TEST) A16.15(TST2) A17.15(TST2) M1.1 M1.2 M1.3 M1.PE1(MT) M1.PE2(MT) M1.PE(MT) M1.PE@(MT) M2.1 M2.3 M2.PE1(MT) M2.PE2(MT) M2.PE(MT) M2.PE@(MT) R18.E R25.E X1.3 X1.4

### Notes on the sheet
- dual DACs, only one is needed
- RC4580 OP amp
- 12.5khz cutoff LPF
- volume | DC block, cca 29hz cutoff @32 ohm headphones
- current limit
- CH2
- MOSI
- CH1
- SCK
- minimum
- 1.6hz cutoff
- AC ground
- CH2
- 16bit shift register, to OPL3s via SPI0
- CH1
- bonus lvl1
- bonus lvl2
- MIDI in
- CH2
- CH1
- MIDI out
- CH2
- CH1

## Library data of the parts
A1 = SamacSys_Parts:PICO: RP2040 microcontroller chip designed by Raspberry Pi in the United Kingdom 2 SPI, 2 I2C, 2 UART, 3 12-bit ADC, 16 controllable PWM channels Source: Datasheet <https://datasheets.raspberrypi.org/pico/pico_datasheet.pdf>; DESCRIPTION: RP2040 microcontroller chip designed by Raspberry Pi in the United Kingdom 2 SPI, 2 I2C, 2 UART, 3 12-bit ADC, 16 controllable PWM channels; HEIGHT: 1mm; MANUFACTURER_NAME: RASPBERRY-PI; MANUFACTURER_PART_NUMBER: PICO
A2 A4 A5 = 74xx-eu:74*14: Hex schmitt trigger INVERTER
A3 = linear:78*: Positive VOLTAGE REGULATOR Source: http://cache.national.com/ds/LM/LM78L05.pdf http://www.fairchildsemi.com/ds/LM/LM7805.pdf
A6 A14 = 74xx-eu:74*595: 8-bit SHIFT REGISTER, output latch
A7 A15 = SamacSys_Parts:YMF262-M: SOUND GENERATOR CIRCUIT, 24 Pin, SOP Source: Datasheet <https://datasheet.datasheetarchive.com/originals/distributors/Datasheets-30/DSA-593149.pdf>; DESCRIPTION: SOUND GENERATOR CIRCUIT, 24 Pin, SOP; HEIGHT: 2.5mm; MANUFACTURER_NAME: Yamaha; MANUFACTURER_PART_NUMBER: YMF262-M
A8 A9 A16 A17 = SamacSys_Parts:YAC512-M: Digital Analog Converter, Single, 16 Bit, 16 Pin, SOP Source: Datasheet <https://www.dosdays.co.uk/topics/images/YAC512-Yamaha.pdf>; DESCRIPTION: Digital Analog Converter, Single, 16 Bit, 16 Pin, SOP; HEIGHT: 2.3mm; MANUFACTURER_NAME: Yamaha; MANUFACTURER_PART_NUMBER: YAC512-M
A10-A13 A18-A22 = linear:*1458: OP AMP
A23 A24 = 74xx-eu:74*165: 8-bit parallel load SHIFT REGISTER
A25-A27 = 40xx:4051: 8-channel ANALOG MULTIPLEXER
A28 = linear:LM2903: COMPARATOR
A29 = 74xx-little-de:74*1G14: Single Schmitt-Trigger Inverter Gate
C1-C39 C41-C46 C48-C82 = 0Discrete:C: SMD Sizes: imperial metric 0402 1005 0603 1608 0805 2012 1206 3216 1210 3225 1812 4632 2220 5750
C40 C47 = rcl:CPOL-EU: POLARIZED CAPACITOR, European symbol; SPICEPREFIX: C
D1-D5 = diode:DIODE-: DIODE
D6-D9 = 0Opto:LED
J1 R1-R17 R19-R24 R26-R55 R58-R62 R65 R66 R69-R72 R77 R78 = 0Discrete:R: Resistor vcetne SMD
J2 = con-jack:DCJ0303: DC POWER JACK Source: DCJ0303.pdf; OC_FARNELL: unknown; OC_NEWARK: unknown
JP1 = pinhead:PINHD-1X6: PIN HEADER
JP2-JP4 = pinhead:PINHD-1X5: PIN HEADER
K1-K10 = 0Konektor:K1
L1-L12 = adafruit:LED: LED OSRAM: - CHIPLED LG R971, LG N971, LY N971, LG Q971, LY Q971, LO R971, LY R971 LH N974, LH R974 LS Q976, LO Q976, LY Q976 LO Q996 - Hyper CHIPLED LW Q18S LB Q993, LB Q99A, LB R99A - SideLED LS A670, LO A670, LY A670, LG A670, LP A670 LB A673, LV A673, LT A673, LW A673 LH A674 LY A675 LS A676, LA A676, LO A676, LY A676, LW A676 LS A679, LY A679, LG A679 - Hyper Micro SIDELED® LS Y876, LA Y876, LO Y876, LY Y876 LT Y87S - SmartLED LW L88C, LW L88S LB L89C, LB L89S, LG L890 LS L89K, LO L89K, LY L89K LS L896, LA L896, LO L896, LY L896 - TOPLED LS T670, LO T670, LY T670, LG T670, LP T670 LSG T670, LSP T670, LSY T670, LOP T670, LYG T670 LG T671, LOG T671, LSG T671 LB T673, LV T673, LT T673, LW T673 LH T674 LS T676, LA T676, LO T676, LY T676, LB T676, LH T676, LSB T676, LW T676 LB T67C, LV T67C, LT T67C, LS T67K, LO T67K, LY T67K, LW E67C LS E67B, LA E67B, LO E67B, LY E67B, LB E67C, LV E67C, LT E67C LW T67C LS T679, LY T679, LG T679 LS T770, LO T770, LY T770, LG T770, LP T770 LB T773, LV T773, LT T773, LW T773 LH T774 LS E675, LA E675, LY E675, LS T675 LS T776, LA T776, LO T776, LY T776, LB T776 LHGB T686 LT T68C, LB T68C - Hyper Mini TOPLED® LB M676 - Mini TOPLED Santana® LG M470 LS M47K, LO M47K, LY M47K Source: http://www.osram.convergy.de/
M1 M2 = adafruit:MIDIJACK: DIN 5 jack also known as MIDI jack A modification of conn-hirshman:MAB5SH with two options for the grounding 'teeth'
OK1 = optocoupler:PC817: SHARP OPTO COUPLER; MPN: PC817X4J000F; OC_FARNELL: 9707727; OC_NEWARK: 97K7059
P1-P4 P6 P8 P10 R18 R25 R56 R57 R74 = pot:TRIM_EU-: POTENTIOMETER
Q1-Q12 = SamacSys_Parts:TEFT4300: Vishay TEFT4300 60 Infrared Phototransistor, Through-hole 3mm Package Source: Datasheet <https://datasheet.datasheetarchive.com/originals/distributors/Datasheets-310/86913.pdf>; ARROW_PART_NUMBER: TEFT4300; ARROW_PRICE-STOCK: https://www.arrow.com/en/products/teft4300/vishay?region=nac; DESCRIPTION: Vishay TEFT4300 60 Infrared Phototransistor, Through-hole 3mm Package; HEIGHT: 6.1mm; MANUFACTURER_NAME: Vishay; MANUFACTURER_PART_NUMBER: TEFT4300; MOUSER_PART_NUMBER: 782-TEFT4300; MOUSER_PRICE-STOCK: https://www.mouser.co.uk/ProductDetail/Vishay-Semiconductors/TEFT4300?qs=HsFHTXumnCRbcrt8oPFPMA%3D%3D
Q13 = crystal:CSM-7X-DU: SMD CRYSTAL Source: www.ecsxtal.com .. Crystal 3.6864MHz CSM_7X_DU.PDF; OC_FARNELL: unknown; OC_NEWARK: unknown
S1-S16 = SamacSys_Parts:101-TS6211T1603-EV: Tactile Switches 12x12mm 160gf BROWN Source: Datasheet <https://componentsearchengine.com/Datasheets/1/101-TS6211T1603-EV.pdf>; DESCRIPTION: Tactile Switches 12x12mm 160gf BROWN; HEIGHT: 8.5mm; MANUFACTURER_NAME: Mountain Switch; MANUFACTURER_PART_NUMBER: 101-TS6211T1603-EV; MOUSER_PART_NUMBER: 101-TS6211T1603-EV; MOUSER_PRICE-STOCK: https://www.mouser.co.uk/ProductDetail/Mountain-Switch/101-TS6211T1603-EV?qs=fPCSDLBQ1WShwkcARVh09A%3D%3D
X1 = adafruit:STEREOJACK: MIC/HEADPHONE JACK Stereo jack with two switches. Kycon STX3100, CUI SJ1-3555NG and/or 4UCon 05544